# Altium schematic sheet P1.schdoc
size 297 x 209 mm; Symbol: Drawing-Symbol_A4; Company: 寒灵猫; Version: V1.0; Page Size: A4; @Project Name: 平衡小车; @Update Date: 2026-02-09; @Create Date: 2026-02-09; Device: Drawing-Symbol_A4; @Board Name: Board1; @Page Name: P1; @Create Time: 11:24:06; @Page Count: 1; @Page No: 1; @Schematic Name: Schematic1; @Update Time: 11:24:06; @Assembly Variant: Basic; Border: 1; Title Block Position: 3; Size: A4; Width: 1170; Height: 825; Region Start: 1; X Region Count: 6; Y Region Count: 4; Blade Width: 10; Title Block: 1
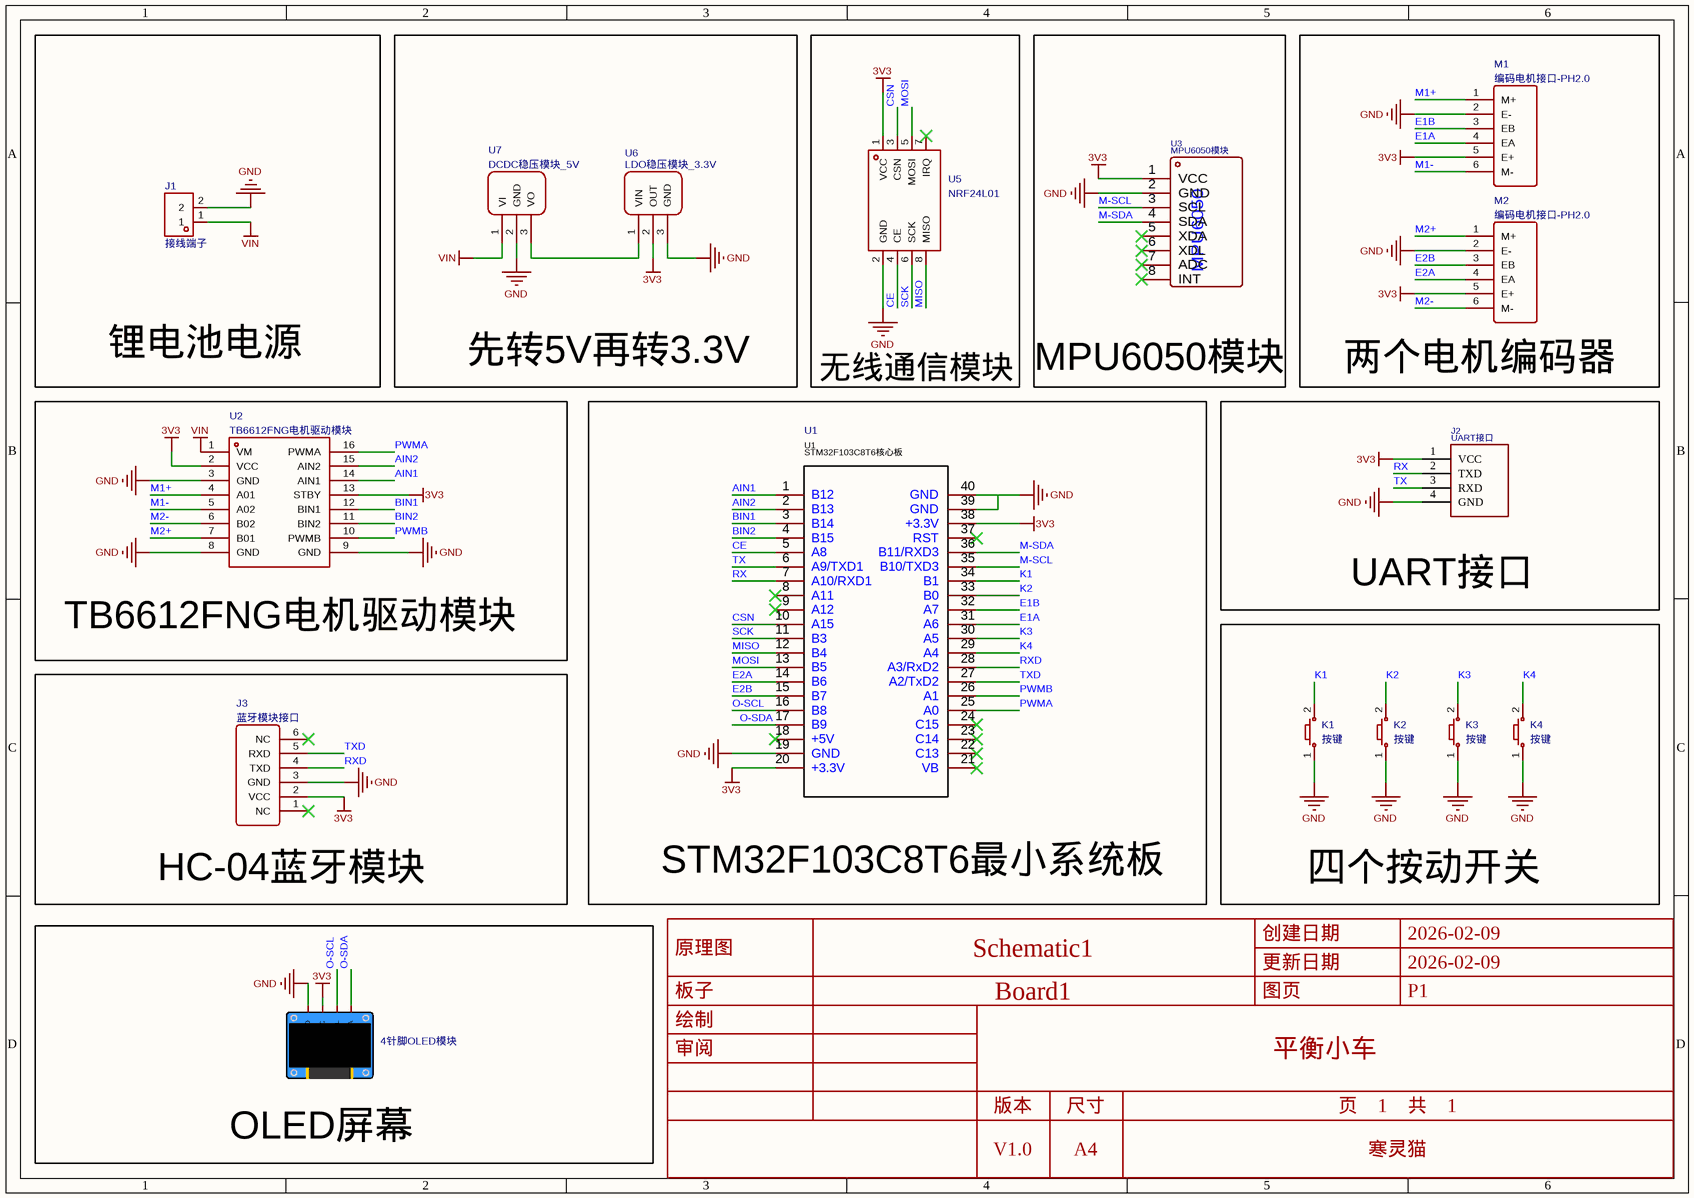
[diagram p0: P1.schdoc]

## Parts
4针脚OLED模块  (no value)  [0.96OLED_4P]
J1  接线端子  [CONN-TH_P5.00_KF301-5.0-2P]
J2  UART接口  [UART]
J3  蓝牙模块接口  [HDR-TH_6P-P2.54-V-F]
K1  按键  [Key_SMD_3x4x2]
K2  按键  [Key_SMD_3x4x2]
K3  按键  [Key_SMD_3x4x2]
K4  按键  [Key_SMD_3x4x2]
M1  编码电机接口-PH2.0  [HDR-TH_6P-P2.54-V-M-B]
M2  编码电机接口-PH2.0  [HDR-TH_6P-P2.54-V-M-B]
U1  (no value)  [STM32F103C8T6最小系统板]
U2  TB6612FNG电机驱动模块  [TB6612FNG]
U3  MPU6050模块  [MPU6050模块]
U5  NRF24L01  [WIRELM-SMD_L28.6-W15.3-P2.54_NRF24L01]
U6  LDO稳压模块_3.3V  [HDR-TH_3P-P2.54-V-M-B]
U7  DCDC稳压模块_5V  [HDR-TH_3P-P2.54-V-M-B]

## Blocks framed on the sheet
锂电池电源: J1
先转5V再转3.3V: U6 U7
无线通信模块: U5
MPU6050模块: U3
两个电机编码器: M1 M2
TB6612FNG电机驱动模块: U2
STM32F103C8T6最小系统板: U1
UART接口: J2
四个按动开关: K1-K4
HC-04蓝牙模块: J3
OLED屏幕: 4针脚OLED模块

## Nets
3V3: 4针脚OLED模块.2(VCC) J2.1(VCC) J3.2(VCC) M1.5(E+) M2.5(E+) U1.20(+3.3V) U1.38(+3.3V) U2.2(VCC) U2.13(STBY) U3.1(VCC) U5.1(VCC) U6.2(OUT)
GND: 4针脚OLED模块.1(GND) J1.2 J2.4(GND) J3.3(GND) K1.1 K2.1 K3.1 K4.1 M1.2(E-) M2.2(E-) U1.19(GND) U1.39(GND) U1.40(GND) U2.3(GND) U2.8(GND) U2.9(GND) U3.2(GND) U5.2(GND) U6.3(GND) U7.2(GND)
VIN: J1.1 U2.1(VM) U7.1(VI)
AIN1: U1.1(B12) U2.14(AIN1)
AIN2: U1.2(B13) U2.15(AIN2)
BIN1: U1.3(B14) U2.12(BIN1)
BIN2: U1.4(B15) U2.11(BIN2)
CE: U1.5(A8) U5.4(CE)
CSN: U1.10(A15) U5.3(CSN)
E1A: M1.4(EA) U1.31(A6)
E1B: M1.3(EB) U1.32(A7)
E2A: M2.4(EA) U1.14(B6)
E2B: M2.3(EB) U1.15(B7)
K1: K1.2 U1.34(B1)
K2: K2.2 U1.33(B0)
K3: K3.2 U1.30(A5)
K4: K4.2 U1.29(A4)
M1+: M1.1(M+) U2.4(A01)
M1-: M1.6(M-) U2.5(A02)
M2+: M2.1(M+) U2.7(B01)
M2-: M2.6(M-) U2.6(B02)
M-SCL: U1.35(B10/TXD3) U3.3(SCL)
M-SDA: U1.36(B11/RXD3) U3.4(SDA)
MISO: U1.12(B4) U5.8(MISO)
MOSI: U1.13(B5) U5.5(MOSI)
O-SCL: 4针脚OLED模块.3(SCL) U1.16(B8)
O-SDA: 4针脚OLED模块.4(SDA) U1.17(B9)
PWMA: U1.25(A0) U2.16(PWMA)
PWMB: U1.26(A1) U2.10(PWMB)
RX: J2.2(TXD) U1.7(A10/RXD1)
RXD: J3.4(TXD) U1.28(A3/RxD2)
SCK: U1.11(B3) U5.6(SCK)
TX: J2.3(RXD) U1.6(A9/TXD1)
TXD: J3.5(RXD) U1.27(A2/TxD2)
NetU6_1: U6.1(VIN) U7.3(VO)

Not connected (* = marked no-connect by the designer): J3 1(NC)* 6(NC)*; U1 8(A11)* 9(A12)* 18(+5V)* 21(VB)* 22(C13)* 23(C14)* 24(C15)* 37(RST)*; U3 5(XDA)* 6(XDL)* 7(ADC)* 8(INT)*; U5 7(IRQ)*

## Notes on the sheet
- 创建日期
- 2026-02-09
- 原理图
- 板子
- Schematic1
- Board1
- 更新日期
- 图页
- P1
- 绘制
- 审阅
- 平衡小车
- 版本
- V1.0
- 尺寸
- A4
- 页    1    共    1
- 寒灵猫
- (in symbol STM32F103C8T6最小系统板) STM32F103C8T6核心板

## Library data of the parts
4针脚OLED模块 = 0.96OLED模块_4P: ConvertToPcb: yes; ModelId: 79c000fdb68d45a296c2e9bedf4f90550819f05c4eef4c71ace90d822a990e87; ModelTransform: 1393.69792,1318.895,0,0,0,0,0,-560.079,-137.795; Symbol: 0.96OLED模块_4P; Device: 0.96OLED模块_4P; AddInBom: yes; FootprintName: 0.96OLED_4P; Supplier Footprint: 插件; ModelName: 0.96OLED_4P
J1 = KF301-5.0-2P: 结构:1x2P;间距:5mm;颜色:蓝色;安装方式:直插;排数:1;每排PIN数:2;额定电流:17A;额定电压:250V;线规 - AWG:14~22;线规 - 平方毫米:1.5;工作温度:-30℃~+120℃;; Manufacturer: KEFA(科发); AddInBom: yes; ModelId: 442de893d0fc4728b9e5c7abc29ccda50819f05c4eef4c71ace90d822a990e87; ModelTransform: 417.322,299.21594,0,0,0,0,11.811,7.874,-137.795; Number of Positions or Pins: 1x2P; Pitch: 5mm; Number of PINs Per Row: 2; Current Rating: 17A; Voltage Rating (Max): 250V; Wire Gauge - AWG: 14~22; Wire Gauge - mm2: 1.5; Symbol: KF301-5.0-2P; Device: KF301-5.0-2P; Manufacturer Part: 接线端子; LCSC Part Name: 1x2P 5mm 直插 排数:1 每排P数:2; SupplierPart: C474881; Supplier Footprint: 插件,P=5mm; JLCPCB Part Class: Extended Part; Datasheet: https://item.szlcsc.com/datasheet/KF301-5.0-2P/481499.html; Supplier: LCSC; ConvertToPcb: yes; FootprintName: CONN-TH_P5.00_KF301-5.0-2P; ModelName: CONN-TH_P5.00_KF301-5.0-2P; Color: 蓝色; Mounting Type: 直插; Number of Pins: 2P; Number of Rows: 1; Operating Temperature: -30℃~+120℃
J2 = UART: Symbol: UART; Device: UART; FootprintName: UART
J3 = 蓝牙模块接口: AddInBom: yes; Symbol: 蓝牙模块接口; Device: 蓝牙模块接口; FootprintName: HDR-TH_6P-P2.54-V-F; ConvertToPcb: yes; Description: 蓝牙模块接口
K1-K4 = Key_SMD_3x4x2: Symbol: 轻触按键x2; ConvertToPcb: yes; ModelId: 63599cce708d48afbce1b0db003544770819f05c4eef4c71ace90d822a990e87; ModelName: SW-SMD_L4.0-W2.9-H2-LS5.0; ModelTransform: 196.85,114.17,79.13,0,0,0,0,0,0; Device: Key_SMD_3x4x2; AddInBom: yes; Supplier Footprint: SMD; FootprintName: Key_SMD_3x4x2
M1 M2 = 编码电机接口-PH2.0: AddInBom: yes; Symbol: 编码电机接口-PH2.0; Device: 编码电机接口-PH2.0; FootprintName: HDR-TH_6P-P2.54-V-M-B; ConvertToPcb: yes; Description: 编码电机接口-PH2.0
U1 = STM32F103C8T6最小系统板: AddInBom: yes; Symbol: STM32F103C8T6最小系统板; Device: STM32F103C8T6最小系统板; FootprintName: STM32F103C8T6最小系统板; ConvertToPcb: yes
U2 = TB6612FNG: AddInBom: yes; ModelId: 245d1cb94cf94afabee37b335055e73auser; ModelName: TB6612FNG模块; ModelTransform: 822.998342706345,829.9088255743997,702.84375,0,0,0,0,0,-118.11024; Symbol: TB6612FNG; Device: TB6612FNG; ConvertToPcb: yes; FootprintName: TB6612FNG
U3 = MPU6050: Symbol: MPU6050; Device: MPU6050; FootprintName: MPU6050模块
U5 = NF-04: 模式:收发;频率:2.4GHz;天线形式:板载PCB天线;接收灵敏度:-96dBm;; Manufacturer: Ai-Thinker(安信可); AddInBom: yes; ModelId: f072db71e2c147f5822da1efa21fb3b90819f05c4eef4c71ace90d822a990e87; ModelTransform: 602.361,1125.982,0,0,0,0,-64.766,-442.716,-236.22; Model: 收发; Modulation System: GFSK; Output Power(Max): 4dBm; Interface Type: SPI; Voltage - Supply: 1.9V~3.6V; Receive  Current: 16.5mA; Send  Current: 18mA; Sensitivity: -96dBm; Symbol: NRF24L01; Device: NF-04; Value: NRF24L01; LCSC Part Name: NF-04 功率加强版 绑定 2.4G无线模块; ManufacturerPart: NF-04; Supplier Footprint: 插件; JLCPCB Part Class: Extended Part; Datasheet: https://item.szlcsc.com/datasheet/NF-04/91939.html; Supplier: LCSC; ConvertToPcb: yes; FootprintName: WIRELM-SMD_L28.6-W15.3-P2.54_NRF24L01; ModelName: WIRELM-SMD_L28.6-W15.3-P2.54_NRF24L01; Antenna Type: 板载PCB天线; Operating Temperature: -20℃~+70℃
U6 = LDO稳压模块_3.3V: AddInBom: yes; Symbol: LDO稳压模块_3.3V; Device: LDO稳压模块_3.3V; ConvertToPcb: yes; Description: LDO稳压模块_3.3V
U7 = DC-DC转5V: AddInBom: yes; Symbol: DC-DC转5V; Device: DC-DC转5V; FootprintName: HDR-TH_3P-P2.54-V-M-B; ConvertToPcb: yes; Description: DC-DC转5V